# EAGLE design smalAtmBoard (EAGLE 7.6.0)
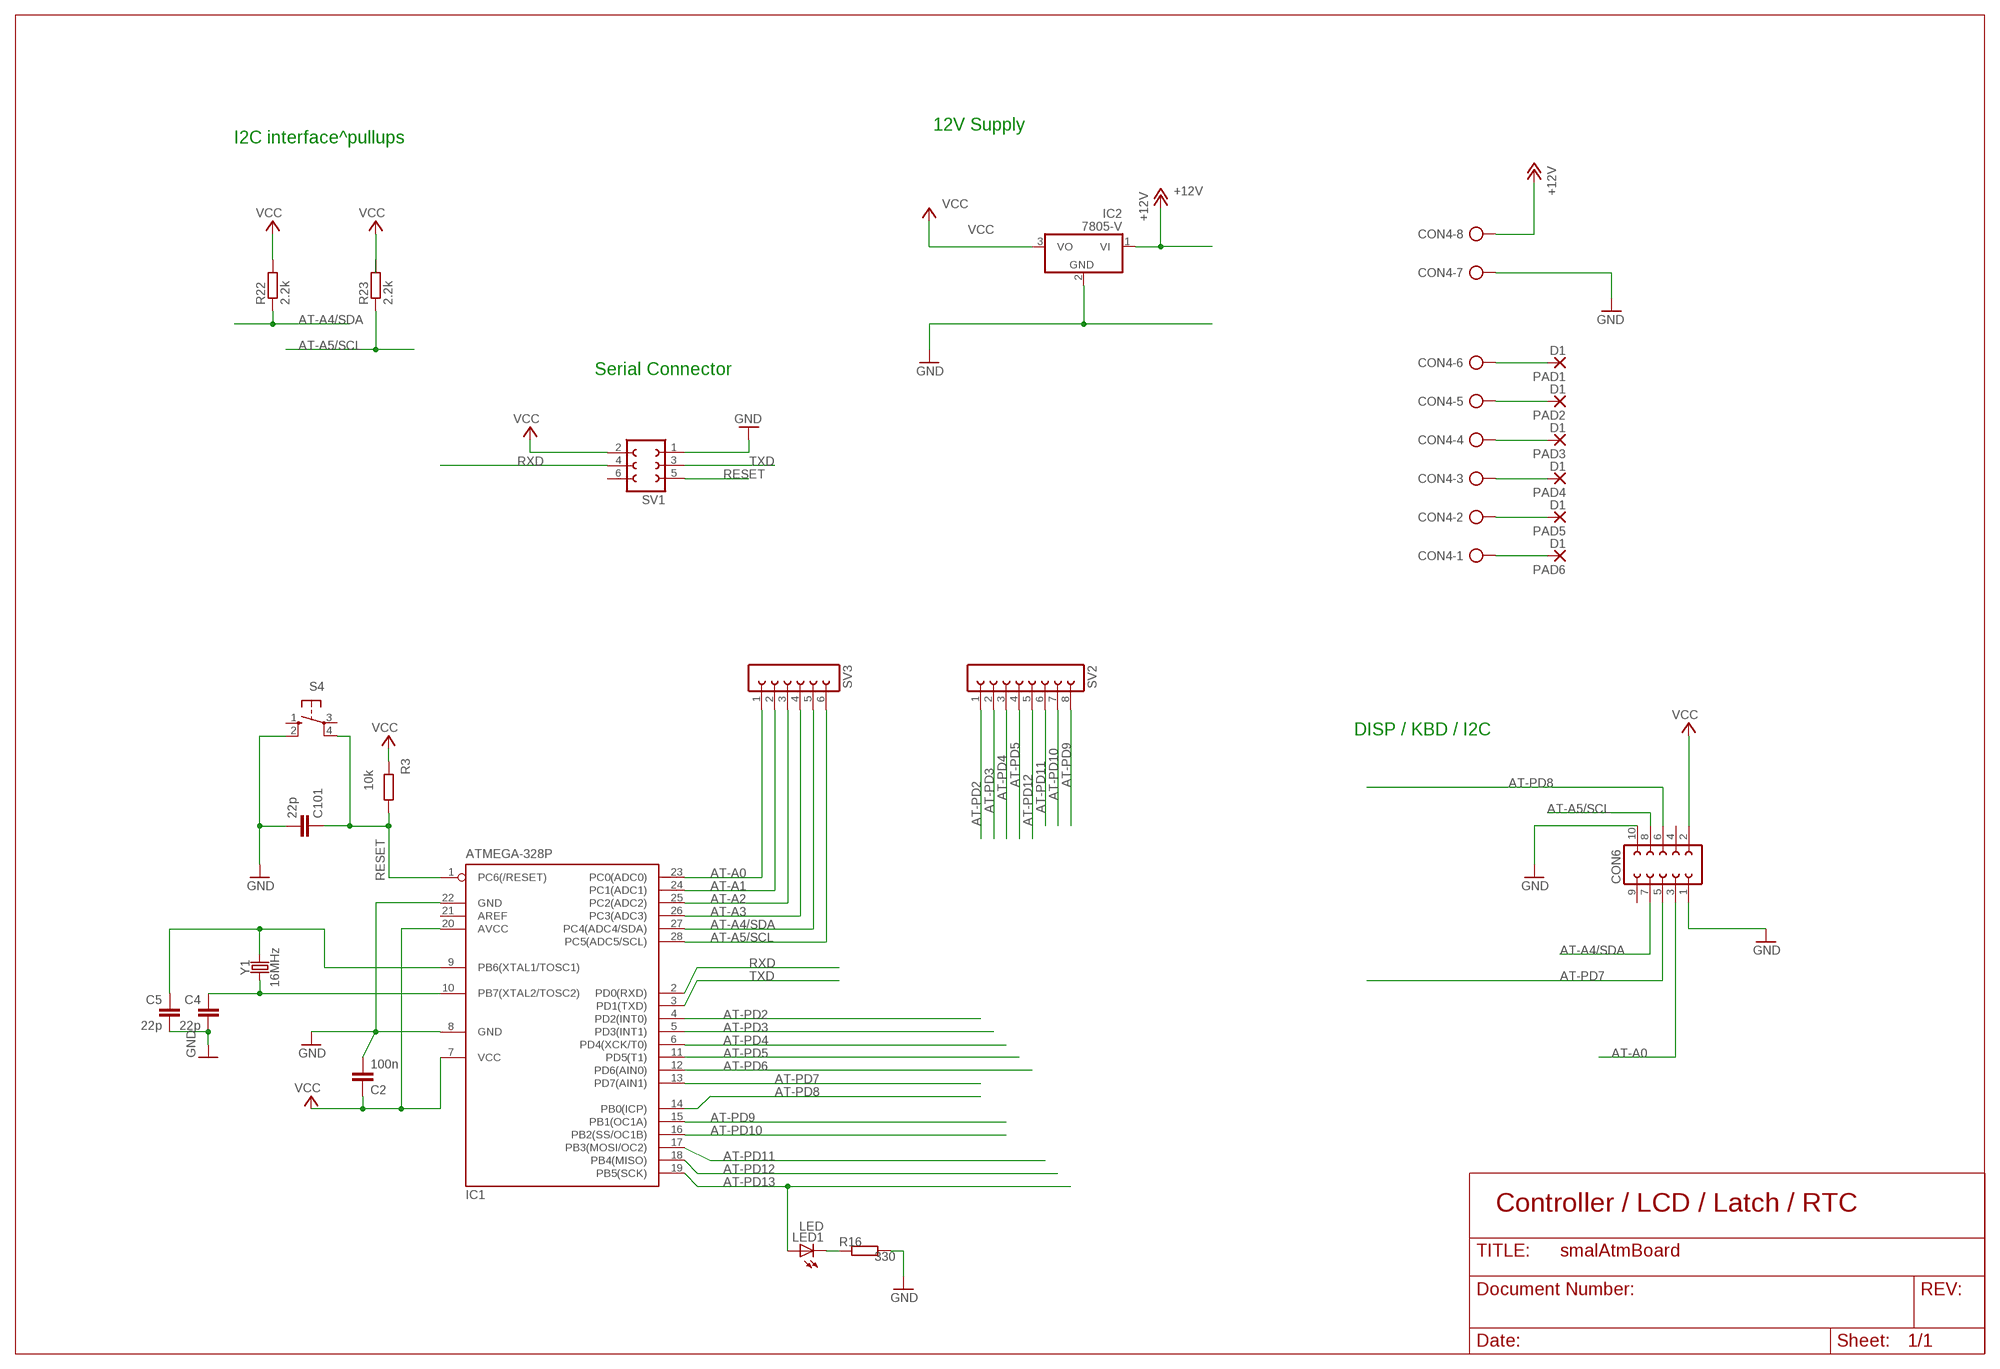
[diagram p0: schematic, sheet 1]

## Parts
C2  100n  C-55MM  [C050-024X044]
C4  22p  C-55MM  [C050-024X044]
C5  22p  C-55MM  [C050-024X044]
C101  22p  C-55MM  [C050-024X044]
CON4  AK300/8  [AK300/8]
CON6  FE05-2  [FE05-2]
IC1  ATMEGA-328P  ATMEGA-XX8-P  [DIL28-3]
IC2  7805-V  [TO220V]
LED1  LED  [LED_LD260]
PAD1  D1  PAD1,6/0,8  [PAD1,6/0,8]
PAD2  D1  PAD1,6/0,8  [PAD1,6/0,8]
PAD3  D1  PAD1,6/0,8  [PAD1,6/0,8]
PAD4  D1  PAD1,6/0,8  [PAD1,6/0,8]
PAD5  D1  PAD1,6/0,8  [PAD1,6/0,8]
PAD6  D1  PAD1,6/0,8  [PAD1,6/0,8]
R3  10k  R-EU_0207/2V  [R_0207/2V]
R16  330  R-EU_0207/2V  [R_0207/2V]
R22  2.2k  R-EU_0207/2V  [R_0207/2V]
R23  2.2k  R-EU_0207/2V  [R_0207/2V]
S4  10-XX  [B3F-10XX]
SV1  FE03-2FE03-2RAW  [FE03-2RAW]
SV2  FE08-1  [FE08]
SV3  FE06-1  [FE06]
Y1  16MHz  CRYSTALPTH-HC49US  [HC49US]

## Nets
+12V: CON4.8 IC2.1(VI)
AT-A0: CON6.3 IC1.23(PC0(ADC0)) SV3.1
AT-A1: IC1.24(PC1(ADC1)) SV3.2
AT-A2: IC1.25(PC2(ADC2)) SV3.3
AT-A3: IC1.26(PC3(ADC3)) SV3.4
AT-A4/SDA: CON6.7 IC1.27(PC4(ADC4/SDA)) R22.1 SV3.5
AT-A5/SCL: CON6.8 IC1.28(PC5(ADC5/SCL)) R23.1 SV3.6
AT-PD2: IC1.4(PD2(INT0)) SV2.1
AT-PD3: IC1.5(PD3(INT1)) SV2.2
AT-PD4: IC1.6(PD4(XCK/T0)) SV2.3
AT-PD5: IC1.11(PD5(T1)) SV2.4
AT-PD6: IC1.12(PD6(AIN0))
AT-PD7: CON6.5 IC1.13(PD7(AIN1))
AT-PD8: CON6.6 IC1.14(PB0(ICP))
AT-PD9: IC1.15(PB1(OC1A)) SV2.8
AT-PD10: IC1.16(PB2(SS/OC1B)) SV2.7
AT-PD11: IC1.17(PB3(MOSI/OC2)) SV2.6
AT-PD12: IC1.18(PB4(MISO)) SV2.5
AT-PD13: IC1.19(PB5(SCK)) LED1.A
GND: C2.2 C4.2 C5.2 C101.2 CON4.7 CON6.1 CON6.10 IC1.8(GND) IC1.22(GND) IC2.2(GND) R16.1 S4.2(S1) SV1.1
N$1: LED1.K(C) R16.2
N$21: CON4.6 PAD1.1(P)
N$22: CON4.5 PAD2.1(P)
N$23: CON4.4 PAD3.1(P)
N$24: CON4.3 PAD4.1(P)
N$25: CON4.2 PAD5.1(P)
N$26: CON4.1 PAD6.1(P)
RESET: C101.1 IC1.1(PC6(/RESET)) R3.2 S4.4(P1) SV1.5
RXD: IC1.2(PD0(RXD)) SV1.4
TXD: IC1.3(PD1(TXD)) SV1.3
VCC: C2.1 CON6.2 IC1.7(VCC) IC1.20(AVCC) IC2.3(VO) R3.1 R22.2 R23.2 SV1.2
XTAL1: C5.1 IC1.9(PB6(XTAL1/TOSC1)) Y1.2
XTAL2: C4.1 IC1.10(PB7(XTAL2/TOSC2)) Y1.1
Unconnected: CON6.4 CON6.9 IC1.21(AREF) S4.1(S) S4.3(P) SV1.6

## Notes on the sheet
- 12V Supply
- I2C interface^pullups
- Serial Connector
- DISP / KBD / I2C
- Controller / LCD / Latch / RTC

## Library data of the parts
C2 C4 C5 C101 = bauteile_jbt:C-5: standard condensator
CON4 = bauteile_jbt:AK300/8: CONNECTOR; OC_FARNELL: unknown; OC_NEWARK: unknown
CON6 = bauteile_jbt:FE05-2: FEMALE "Wannenbuchse"; OC_FARNELL: unknown; OC_NEWARK: unknown
IC1 = bauteile_jbt:ATMEGA-XX8-P: MICROCONTROLLER 8 Kbytes FLASH, 1 kbytes SRAM, 512 bytes EEPROM, USART, 4-channel 10 bit ADC, 2-channel 8 bit ADC Pin compatible with Atmega48, ATMega88, ATMega168 Source: avr.lbr; OC_FARNELL: unknown; OC_NEWARK: unknown
IC2 = bauteile_jbt:7805
LED1 = bauteile_jbt:LED
PAD1-PAD6 = bauteile_jbt:PAD1,6/0,8: THROUGH-HOLE PAD
R3 R16 R22 R23 = bauteile_jbt:R-EU_: RESISTOR, European symbol
S4 = bauteile_jbt:10-XX: OMRON SWITCH; MPN: B3F-1000; OC_FARNELL: 176432; OC_NEWARK: 36M3542
SV1 = bauteile_jbt:FE03-2: FEMALE "Wannenbuchse"
SV2 = con-lsta:FE08-1: FEMALE HEADER; OC_FARNELL: unknown; OC_NEWARK: unknown
SV3 = con-lsta:FE06-1: FEMALE HEADER; OC_FARNELL: unknown; OC_NEWARK: unknown
Y1 = bauteile_jbt:CRYSTAL: 16MHz Crystal Digikey Example <http://www.digikey.com/product-search/en?keywords=535-9122-1-ND> Frequency: 16MHz Frequency Stability: ±50ppm Frequency Tolerance: ±20ppm Load Capacitance: 18pF SparkFun Products: Pro Micro -5V/16MHz <https://www.sparkfun.com/products/12640> SparkFun Serial Enabled LCD Kit <https://www.sparkfun.com/products/10097>

## Net classes
0 default: width 0.15 mm, drill 0.3 mm, clearance 0.205 mm

## Board
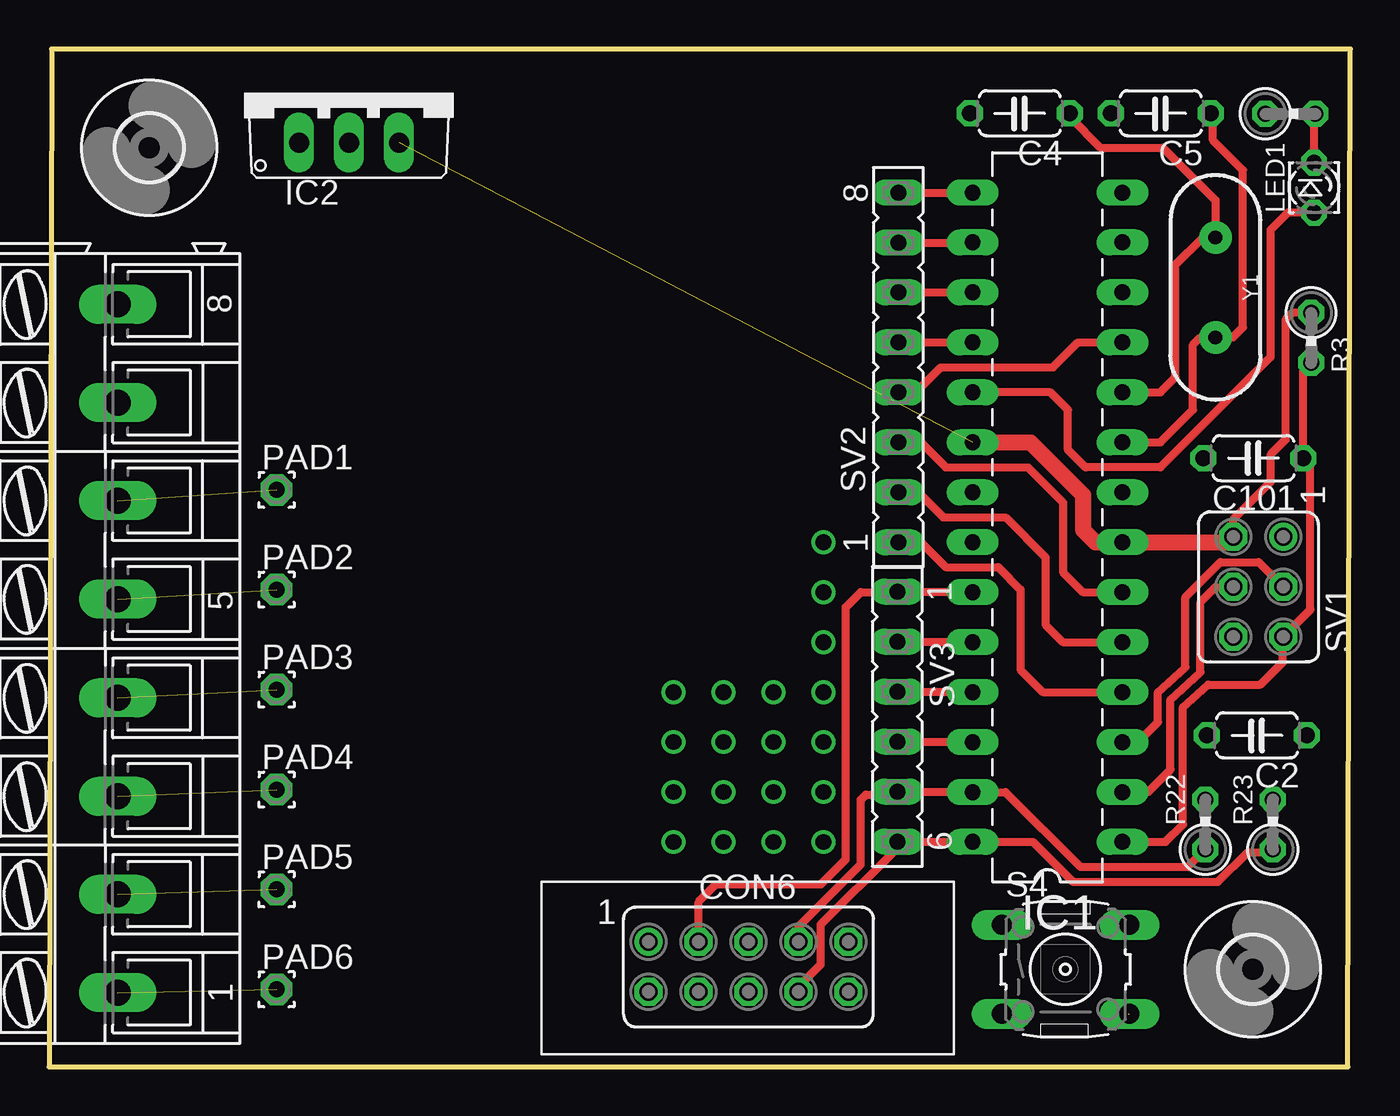
[diagram p1: board, top side]
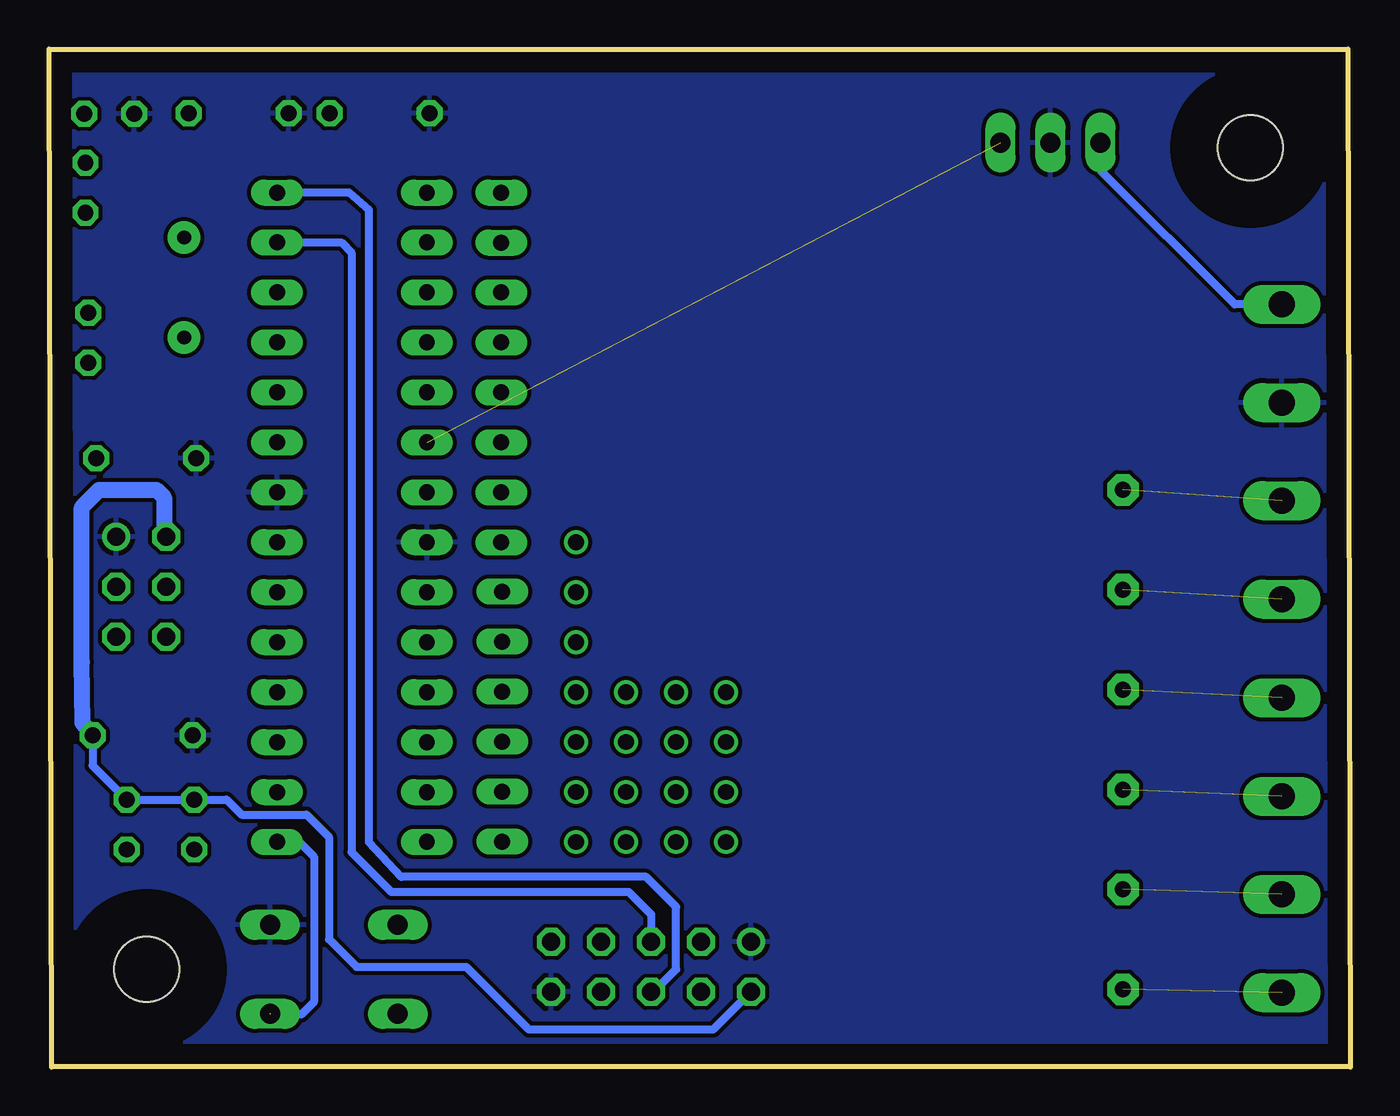
[diagram p2: board, bottom side, seen from below]

Size 66.18 x 51.74 mm. Coordinates in mm from the lower left corner, seen from the top.
Outline: 0,0 66.05,0 66.18,51.74 0.12,51.74 0,0
Copper layers (1*16): Top 0.035mm / dielectric 1.5mm / Bottom 0.035mm
Design rules "default": minimum track width 10mil, minimum drill 24mil, track to track 8mil, track to pad 8mil, pad to pad 8mil, via to via 8mil, smd to smd 8mil, copper to edge 40mil, drill to drill 8mil, minimum pad ring 10mil, minimum via ring 8mil, stop-mask expansion 4mil, vias tented up to drill 0mil, thermal gap 10mil

### Footprints (pad centres in the part's own frame; a part is rotated, then mirrored left to right if it is on the bottom)
C050-024X044 = drill 0.813 octagon: 1 -2.54,0; 2 2.54,0
AK300/8 = drill 1.321 long: 1 -17.501,0; 2 -12.497,0; 3 -7.518,0; 4 -2.515,0; 5 2.515,0; 6 7.518,0; 7 12.497,0; 8 17.501,0
FE05-2 = drill 0.914: 1 -5.08,1.27 | drill 0.914 octagon: 2 -5.08,-1.27; 3 -2.54,1.27; 4 -2.54,-1.27; 5 0,1.27; 6 0,-1.27; 7 2.54,1.27; 8 2.54,-1.27; 9 5.08,1.27; 10 5.08,-1.27
DIL28-3 = drill 0.813 long: 1 -16.51,-3.81; 2 -13.97,-3.81; 3 -11.43,-3.81; 4 -8.89,-3.81; 5 -6.35,-3.81; 6 -3.81,-3.81; 7 -1.27,-3.81; 8 1.27,-3.81; 9 3.81,-3.81; 10 6.35,-3.81; 11 8.89,-3.81; 12 11.43,-3.81; 13 13.97,-3.81; 14 16.51,-3.81; 15 16.51,3.81; 16 13.97,3.81; 17 11.43,3.81; 18 8.89,3.81; 19 6.35,3.81; 20 3.81,3.81; 21 1.27,3.81; 22 -1.27,3.81; 23 -3.81,3.81; 24 -6.35,3.81; 25 -8.89,3.81; 26 -11.43,3.81; 27 -13.97,3.81; 28 -16.51,3.81
TO220V = drill 1.016 long: 1 -2.54,-2.54; 2 0,-2.54; 3 2.54,-2.54
LED_LD260 = drill 0.813 octagon: A -1.27,0; K 1.27,0
PAD1,6/0,8 = drill 0.813 pad 1.6 octagon: 1 0,0
R_0207/2V = drill 0.813 octagon: 1 -1.27,0; 2 1.27,0
B3F-10XX = drill 1.016 long: 1 -3.251,2.261; 2 3.251,2.261; 3 -3.251,-2.261; 4 3.251,-2.261
FE03-2RAW = drill 0.914: 1 -2.54,1.27 | drill 0.914 octagon: 2 -2.54,-1.27; 3 0,1.27; 4 0,-1.27; 5 2.54,1.27; 6 2.54,-1.27
FE08 = drill 0.813 long: 1 -8.89,0; 2 -6.35,0; 3 -3.81,0; 4 -1.27,0; 5 1.27,0; 6 3.81,0; 7 6.35,0; 8 8.89,0
FE06 = drill 0.813 long: 1 -6.35,0; 2 -3.81,0; 3 -1.27,0; 4 1.27,0; 5 3.81,0; 6 6.35,0
3,3 = hole 3.3: 0,0
HC49US = drill 0.7 pad 1.651: 1 -2.54,0; 2 2.54,0

### Placement (x,y rotation side)
C2  61.43,16.85 180 top
C4  49.37,48.48 180 top
C5  56.54,48.48 180 top
C101  61.25,30.95 180 top
CON4  3.49,21.27 90 top
CON6  35.57,5.08 0 top
IC1  50.78,27.94 90 top
IC2  15.25,49.53 0 top
LED1  64.33,44.7 90 top
PAD1  11.56,29.34 0 top
PAD2  11.56,24.26 0 top
PAD3  11.56,19.18 0 top
PAD4  11.56,14.1 0 top
PAD5  11.56,9.02 0 top
PAD6  11.56,3.94 0 top
R3  64.18,37.07 270 top
R16  63.13,48.45 0 top
R22  58.81,12.32 90 top
R23  62.24,12.32 90 top
S4  51.7,4.95 0 top
SV1  61.49,24.41 270 top
SV2  43.19,35.56 90 top
SV3  43.14,17.81 270 top
U$1  [3,3]  61.22,4.95 0 top
U$3  [3,3]  5.09,46.74 0 top
Y1  59.32,39.62 270 top

### Tracks (layer width: path | path; a pad name or v marks a point on that pad's centre or on a via)
+12V
  Bottom 0.406: CON4.8 5.88,38.77 12.71,45.59 IC2.1 12.71,47.75
AT-A0
  Top 0.406: IC1.23 46.97,24.16 SV3.1 43.11,24.13 41.28,24.13 40.52,23.37 40.52,10.54 39.25,9.27 33.92,9.27 33.03,8.38 CON6.3
AT-A1
  Top 0.406: SV3.2 46.97,21.61 IC1.24
AT-A2
  Top 0.406: SV3.3 46.97,19.07 IC1.25
AT-A3
  Top 0.406: SV3.4 46.97,16.54 IC1.26
AT-A4/SDA
  Top 0.406: R22.1 57.92,10.16 52.46,10.16 48.65,13.97 IC1.27 46.97,13.99 SV3.5 42.98,13.84 41.54,13.84 41.28,13.59 41.28,10.29 38.11,7.11 CON6.7
AT-A5/SCL
  Top 0.406: R23.1 62.11,10.92 60.97,10.92 59.44,9.4 52.08,9.4 50.04,11.43 IC1.28 46.97,11.46 SV3.6 42.93,11.25 42.93,10.92 39.25,7.24 39.25,5.21 38.11,4.06 CON6.8
AT-PD2
  Top 0.406: SV2.1 44.33,26.67 45.6,25.4 48.27,25.4 49.41,24.26 49.41,20.19 50.55,19.05 IC1.4
AT-PD3
  Top 0.406: SV2.2 44.2,29.21 45.47,27.94 48.65,27.94 50.68,25.91 50.68,22.48 51.57,21.59 IC1.5
AT-PD4
  Top 0.406: SV2.3 44.33,31.75 45.6,30.48 49.79,30.48 51.57,28.7 51.57,25.15 52.59,24.13 IC1.6
AT-PD5
  Top 0.406: SV2.4 44.08,34.29 45.35,35.56 51.06,35.56 52.33,36.83 IC1.11
AT-PD7
  Bottom 0.406: IC1.13 51.32,41.91 50.81,41.4 50.81,10.92 48.78,8.89 36.71,8.89 35.57,7.75 CON6.5
AT-PD8
  Bottom 0.406: CON6.6 35.44,3.81 34.3,4.95 34.3,8.13 35.82,9.65 48.27,9.65 49.92,11.43 49.92,43.56 50.93,44.45 IC1.14
AT-PD9
  Top 0.406: SV2.8 IC1.15
AT-PD10
  Top 0.406: SV2.7 IC1.16
AT-PD11
  Top 0.406: SV2.6 IC1.17
AT-PD12
  Top 0.406: SV2.5 IC1.18
AT-PD13
  Top 0.406: LED1.A 63,43.43 62.11,42.55 62.11,36.07 56.52,30.48 52.71,30.48 51.82,31.37 51.82,33.4 50.93,34.29 IC1.19
GND
  pour Bottom: 0.9,50.55 65.54,50.55 65.54,0.51 0.9,0.51
N$1
  Top 0.406: LED1.K 64.33,48.39 R16.2
N$2  (via drill 0.8)
  other vias: 39.38,11.43
N$3  (via drill 0.8)
  other vias: 39.38,13.97
N$4  (via drill 0.8)
  other vias: 39.38,16.51
N$5  (via drill 0.8)
  other vias: 39.38,19.05
N$6  (via drill 0.8)
  other vias: 39.38,21.59
N$7  (via drill 0.8)
  other vias: 39.38,24.13
N$8  (via drill 0.8)
  other vias: 39.38,26.67
N$9  (via drill 0.8)
  other vias: 36.84,11.43
N$10  (via drill 0.8)
  other vias: 36.84,13.97
N$11  (via drill 0.8)
  other vias: 36.84,16.51
N$12  (via drill 0.8)
  other vias: 36.84,19.05
N$13  (via drill 0.8)
  other vias: 34.3,11.43
N$14  (via drill 0.8)
  other vias: 34.3,13.97
N$15  (via drill 0.8)
  other vias: 34.3,16.51
N$16  (via drill 0.8)
  other vias: 34.3,19.05
N$17  (via drill 0.8)
  other vias: 31.76,11.43
N$18  (via drill 0.8)
  other vias: 31.76,13.97
N$19  (via drill 0.8)
  other vias: 31.76,16.51
N$20  (via drill 0.8)
  other vias: 31.76,19.05
N$21  (1 unrouted)
N$22  (1 unrouted)
N$23  (1 unrouted)
N$24  (1 unrouted)
N$25  (1 unrouted)
N$26  (1 unrouted)
RESET  (1 unrouted)
  Top 0.406: IC1.1 56.78,11.43 57.67,12.32 57.67,18.29 58.94,19.43 61.6,19.43 62.75,20.57 62.75,21.85 SV1.5 64.14,23.25 64.14,30.6 C101.1 63.79,35.41 R3.2
  Bottom 0.406: IC1.1 53.48,11.43 52.71,10.67 52.71,3.3 53.35,2.67 54.92,2.67
RXD
  Top 0.406: IC1.2 55.89,13.97 57.03,15.11 57.03,18.67 58.55,20.07 58.55,23.62 59.32,24.38 60.2,24.38 SV1.4
TXD
  Top 0.406: IC1.3 55.38,16.51 56.4,17.53 56.4,19.05 57.79,20.32 57.79,23.88 59.57,25.65 61.52,25.65 SV1.3
VCC  (1 unrouted)
  Top 0.406: R3.1 63.23,38.34 62.87,37.97 62.87,31.88 62.11,31.11 62.11,29.72 60.21,27.81 60.21,26.97 SV1.2 | IC1.7
  Top 0.813: IC1.20 49.92,31.75 52.59,29.08 52.59,27.3 53.22,26.67 IC1.7 | IC1.7 59.94,26.67 SV1.2
  Bottom 0.406: C2.1 63.97,15.32 R23.2 R22.2 57.16,13.59 56.4,12.83 53.09,12.83 51.95,11.68 51.95,6.48 50.55,5.08 44.97,5.08 41.79,1.91 32.39,1.91 CON6.2
  Bottom 0.813: C2.1 64.48,17.48 64.52,20.57 64.52,28.45 63.63,29.34 60.71,29.34 60.33,28.96 60.33,27.06 SV1.2
XTAL1
  Top 0.406: IC1.9 56.52,31.75 58.17,33.4 58.17,36.7 58.55,37.08 Y1.2 60.21,37.08 60.71,37.59 60.71,45.59 59.19,47.12 59.19,48.37 C5.1
XTAL2
  Top 0.406: IC1.10 56.52,34.29 57.28,35.05 57.28,40.77 58.68,42.16 Y1.1 59.32,44.07 56.65,46.74 53.47,46.74 51.91,48.3 C4.1

### Text on the board
tValues: 13 | 12 | ~11 | ~D6 | ~D5 | D4 | D1 | ~D3 | D2 | D0 | A5 | A4 | 4 | A3 | A2 | A1
bValues: +12V | VCC | VCC
DrillLegend: LAYER-STACK
DrillLegend_01-16: 01-16
DrillLegend_01-20: 01-20 | 01-20